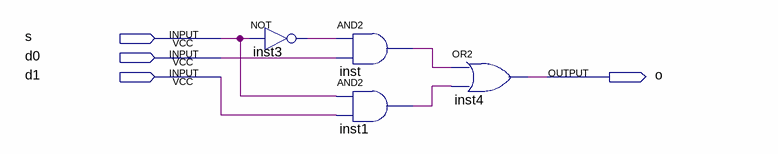
[diagram p0: schematic sheet]
// Quartus schematic 2to1mux.bdf as structural Verilog: 4 symbols, 4 pins
module \2to1mux  (
  input  s,
  input  d0,
  input  d1,
  output o
);

  wire inst1_out, inst3_out, inst_out;

  not inst3 (inst3_out, s);
  and inst (inst_out, inst3_out, d0);
  and inst1 (inst1_out, s, d1);
  or inst4 (o, inst_out, inst1_out);
endmodule
